# Altium schematic sheet test.schdoc
size 358 x 246 mm
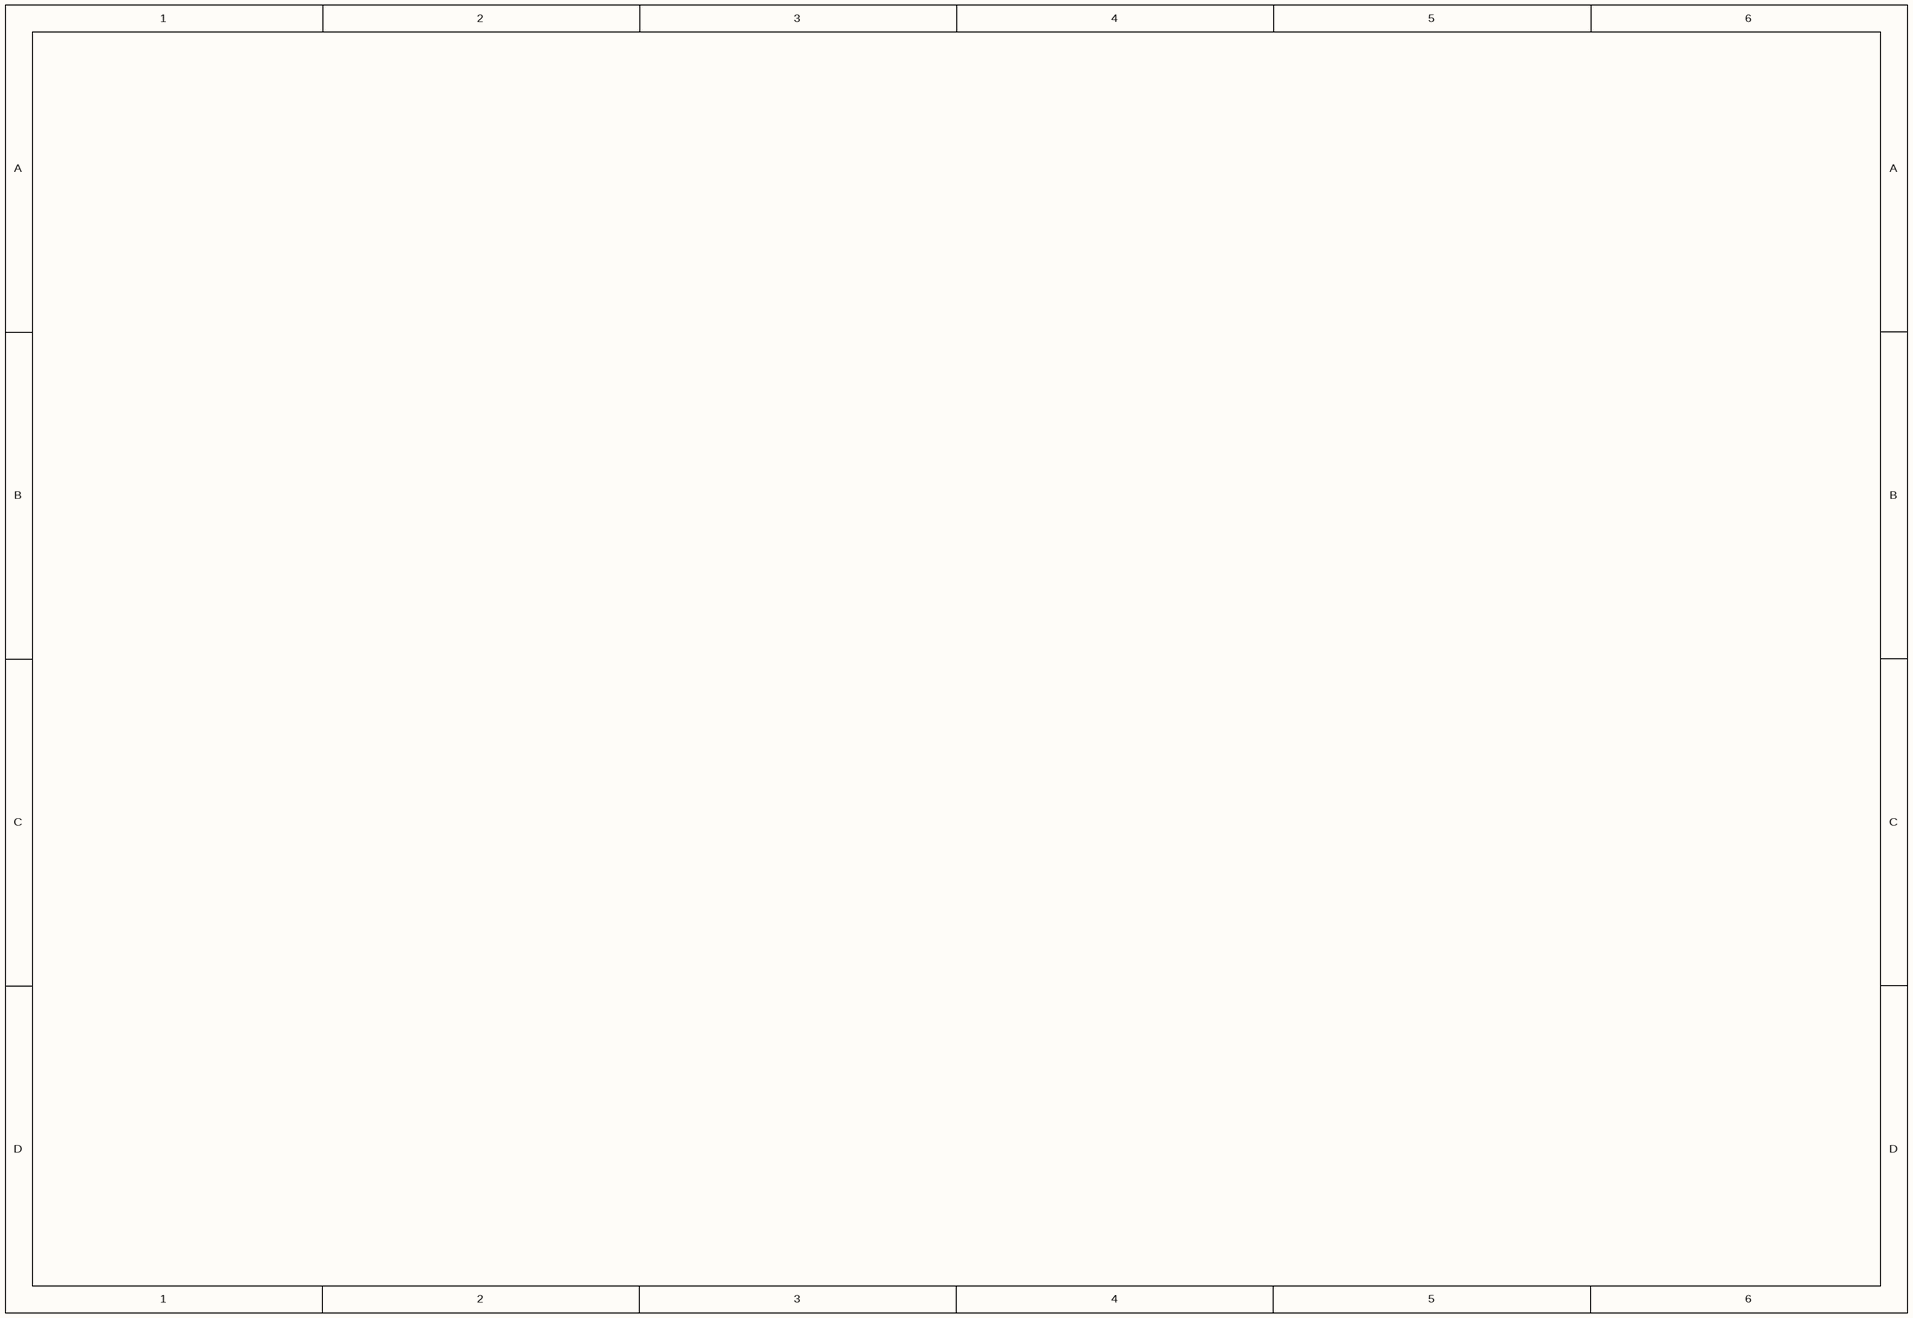
[diagram p0: test.schdoc]

## Parts
L2  KH3216-A55  [ANT-SMD_L3.2-W1.6]
M3_1  铜柱孔M2  [铜柱M2]
M3_2  铜柱孔M2  [铜柱M2]
M3_3  铜柱孔M2  [铜柱M2]
M3_4  铜柱孔M2  [铜柱M2]
U1  HHM1522B1  [FILTER-SMD_6P-L2.0-W1.3-BL]
U2  24AA16T-I/OT  [SOT-23-5_L3.0-W1.7-P0.95-LS2.8-BL]
U3  BMI088  [LGA-16-L4.5-W3.0-P0.50_TL]
U4  BMP388  [PQFN50P200X200X80-10N]
U5  BQ24075RGTR  [QFN-16_L3.0-W3.0-P0.50-BL-EP1.7]
U6  2.4GHz  [QFN-20_L4.0-W4.0-P0.50-BL-EP]
U7  RFX2411  [WQFN-20_L3.0-W3.0-P0.40-BL-EP]

## Nets
NetU4_3: U4.3(VSS) U4.8(VSS) U4.9(VSS)

Not connected (* = marked no-connect by the designer): L2 1 2(NC); U1 1(UNBALANCED_PORT) 2(GND_OR_DC_FEED+RF_GND) 3(BALANCED_PORT) 4(BALANCED_PORT) 5(GND) 6(NC); U2 1(SCL) 2(VSS) 3(SDA) 4(VCC) 5(WP); U3 1(INT2) 2(NC) 3(VDD) 4(GNDA) 5(CSB2) 6(GNDIO) 7(PS) 8(SCL/SCK) 9(SDA/SDI) 10(SDO2) 11(VDDIO) 12(INT3) 13(INT4) 14(CSB1) 15(SDO1) 16(INT1); U4 1(VDIO) 2(SCK) 4(SDI) 5(SDO) 6(CSB) 7(INT) 10(VDD); U5 1(TS) 2(BAT) 3(BAT) 4(#CE) 5(EN2) 6(EN1) 7(#PGOOD) 8(VSS) 9(#CHG) 10(OUT) 11(OUT) 12(ILIM) 13(IN) 14(TMR) 15(SYSOFF) 16(ISET) 17(EP); U6 1(CE) 2(CSN) 3(SCK) 4(MOSI) 5(MISO) 6(IRQ) 7(VDD) 8(VSS) 9(XC2) 10(XC1) 11(VDD_PA) 12(ANT1) 13(ANT2) 14(VSS) 15(VDD) 16(IREF) 17(VSS) 18(VDD) 19(DVDD) 20(VSS) 21(EP); U7 1(GND) 2(N/C) 3(DNC) 4(N/C) 5(TX/RX) 6(TXEN) 7(RXEN) 8(PDET) 9(MODE) 10(SWANT) 11(GND) 12(ANTB) 13(GND) 14(ANTA) 15(IND) 16(DNC) 17(DNC) 18(VDD1) 19(GND) 20(VDD2)

## Library data of the parts
L2 = KH3216-A55: BOM_Manufacturer: Shenzhen Kinghelm Elec; Contributor: LCSC; BOM_Supplier: LCSC; BOM_Supplier Part: C484541; BOM_Manufacturer Part: KH3216-A55; spicePre: L; spiceSymbolName: KH3216-A55
M3_1-M3_4 = 铜柱孔M2: BOM_Manufacturer Part: ZML_铜柱孔M2; Contributor: MATLAB; spicePre: M; spiceSymbolName: 铜柱孔M2
U1 = HHM1522B1: BOM_Manufacturer: TDK; Contributor: LCSC; BOM_Supplier: LCSC; BOM_Supplier Part: C307902; BOM_Manufacturer Part: HHM1522B1; spicePre: U; spiceSymbolName: HHM1522B1
U2 = 24AA16T-I/OT: BOM_Manufacturer: MICROCHIP; Contributor: LCSC; SMT Type: Extend; BOM_Supplier: LCSC; BOM_Manufacturer Part: 24AA16T-I/OT; BOM_Supplier Part: C122879; BOM_LCSC Assembly: Yes; spicePre: U; spiceSymbolName: 24AA16T-I/OT
U3 = BMI088: BOM_Manufacturer: Bosch Sensortec; Contributor: LCSC; SMT Type: Extend; BOM_Supplier: LCSC; BOM_Supplier Part: C194919; BOM_Manufacturer Part: BMI088; BOM_LCSC Assembly: Yes; spicePre: U; spiceSymbolName: BMI088
U4 = BMP388: Contributor: Frank0514; spicePre: U; spiceSymbolName: BMP388
U5 = BQ24075RGTR: BOM_Manufacturer: TI; SMT Type: Extend; BOM_Supplier: LCSC; BOM_Manufacturer Part: BQ24075RGTR; image: //image.lceda.cn/szlcsc/C15464.jpg; BOM_Supplier Part: C15464; BOM_LCSC Assembly: Yes; spicePre: U; spiceSymbolName: BQ24075RGTR
U6 = 2.4GHz: BOM_Manufacturer: NORDIC; BOM_Manufacturer Part: NRF24L01P-R; nameAlias: Frequency; SMT Type: Basic; BOM_Supplier: LCSC; BOM_LCSC Assembly: Yes; image: //image.lceda.cn/szlcsc/C8791.jpg; BOM_Supplier Part: C8791; spicePre: U; spiceSymbolName: NRF24L01P-R
U7 = RFX2411: BOM_Manufacturer: Skyworks Solutions; Contributor: LCSC; SMT Type: Extend; BOM_Supplier: LCSC; BOM_Supplier Part: C150858; BOM_Manufacturer Part: RFX2411; BOM_LCSC Assembly: Yes; spicePre: U; spiceSymbolName: RFX2411